# EAGLE design large_sense_pcb_c (EAGLE 9.6.2)
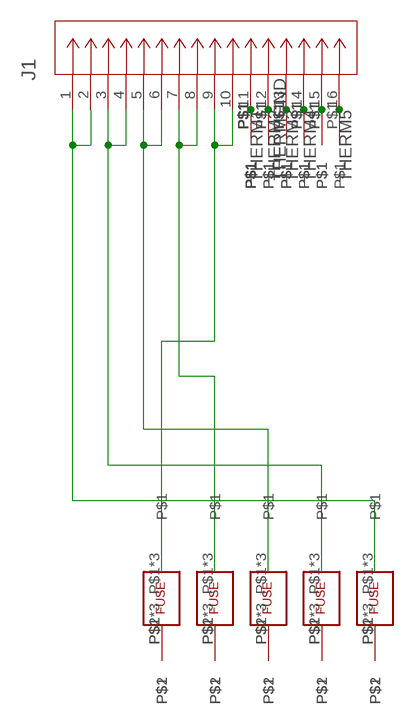
[diagram p0: schematic, sheet 1]

## Parts
J1  DF11-16DP-2DSA(01)  [CONN_DF11-16DP-2DSA(01)_HIR]
U$1  FUSE  [FUSE_PADS]
U$2  FUSE  [FUSE_PADS]
U$3  FUSE  [FUSE_PADS]
U$4  FUSE  [FUSE_PADS]
U$5  FUSE  [FUSE_PADS]
U$6  BB_CONTACT  [BB_CONTACT]
U$7  BB_CONTACT  [BB_CONTACT]
U$8  BB_CONTACT  [BB_CONTACT]
U$9  BB_CONTACT  [BB_CONTACT]
U$10  BB_CONTACT  [BB_CONTACT]
U$12  THERM_PIN  [THERM_PIN]
U$13  THERM_PIN  [THERM_PIN]
U$14  THERM_PIN  [THERM_PIN]
U$15  THERM_PIN  [THERM_PIN]
U$16  THERM_PIN  [THERM_PIN]
U$17  THERM_PIN  [THERM_PIN]
U$18  THERM_PIN  [THERM_PIN]
U$19  THERM_PIN  [THERM_PIN]
U$20  THERM_PIN  [THERM_PIN]
U$22  THERM_PIN  [THERM_PIN]
U$23  THERM_PIN  [THERM_PIN]
U$24  THERM_PIN  [THERM_PIN]
U$25  THERM_PIN  [THERM_PIN]
U$26  THERM_PIN  [THERM_PIN]
U$27  THERM_PIN  [THERM_PIN]
U$28  THERM_PIN  [THERM_PIN]
U$29  THERM_PIN  [THERM_PIN]
U$30  THERM_PIN  [THERM_PIN]

## Nets
N$1: J1.7 J1.8 U$2.P$1 U$2.P$3 U$2.P$5
N$2: U$1.P$2 U$1.P$4 U$1.P$6 U$6.P$1
N$3: J1.1 J1.2 U$5.P$1 U$5.P$3 U$5.P$5
N$4: U$2.P$2 U$2.P$4 U$2.P$6 U$7.P$1
N$5: U$5.P$2 U$5.P$4 U$5.P$6 U$10.P$1
N$6: U$3.P$2 U$3.P$4 U$3.P$6 U$8.P$1
N$7: J1.9 J1.10 U$1.P$1 U$1.P$3 U$1.P$5
N$8: U$4.P$2 U$4.P$4 U$4.P$6 U$9.P$1
N$10: J1.5 J1.6 U$3.P$1 U$3.P$3 U$3.P$5
N$11: J1.3 J1.4 U$4.P$1 U$4.P$3 U$4.P$5
THERM1: J1.12 U$22.P$1 U$23.P$1
THERM2: J1.13 U$24.P$1 U$25.P$1
THERM3: J1.14 U$26.P$1 U$27.P$1
THERM4: J1.15 U$28.P$1 U$29.P$1
THERM5: J1.16 U$30.P$1
THERMGND: J1.11 U$12.P$1 U$13.P$1 U$14.P$1 U$15.P$1 U$16.P$1 U$17.P$1 U$18.P$1 U$19.P$1 U$20.P$1

## Library data of the parts
J1 = sense_pcb_components:DF11-16DP-2DSA(01); COPYRIGHT: Copyright (C) 2023 Ultra Librarian. All rights reserved.; MANUFACTURER_PART_NUMBER: DF11-16DP-2DSA(01); MFR_NAME: Hirose
U$1-U$5 = sense_pcb_components:FUSE
U$6-U$10 = sense_pcb_components:BB_CONTACT
U$12-U$20 U$22-U$30 = sense_pcb_components:THERM_PIN

## Board
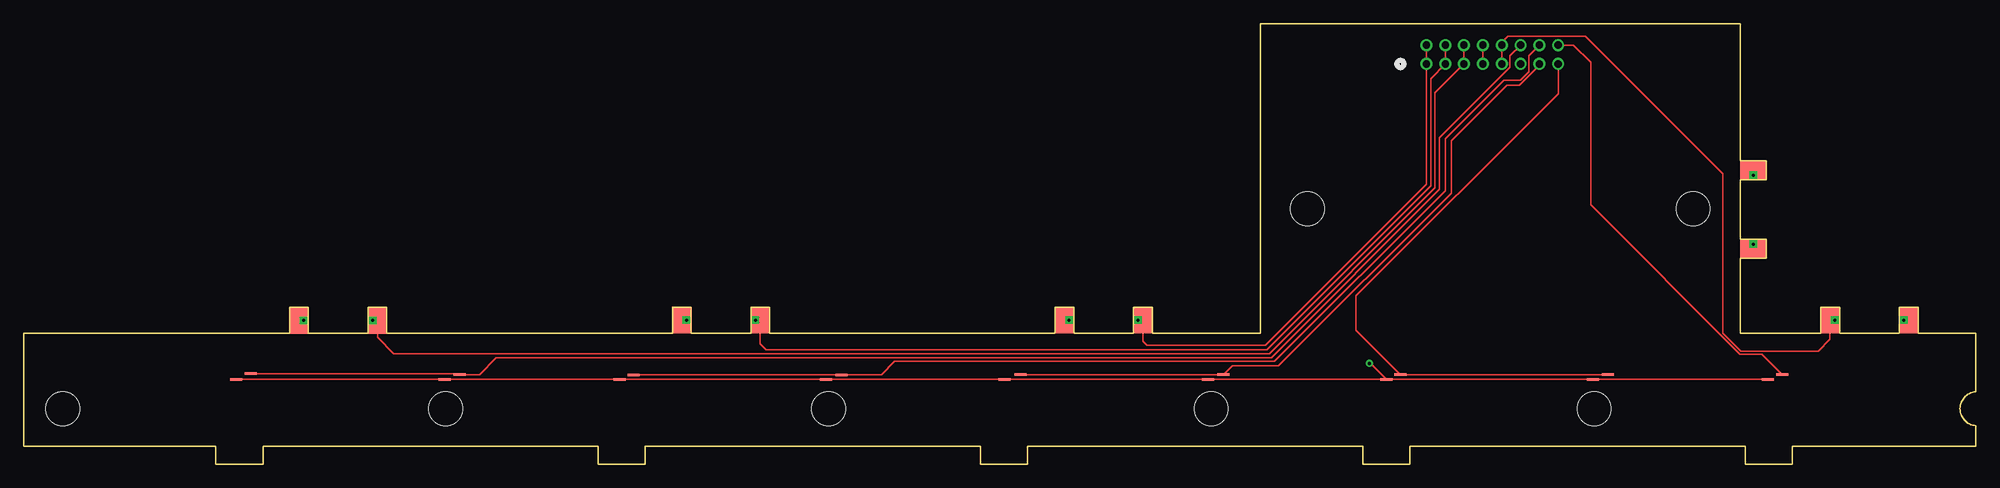
[diagram p1: board, top side]
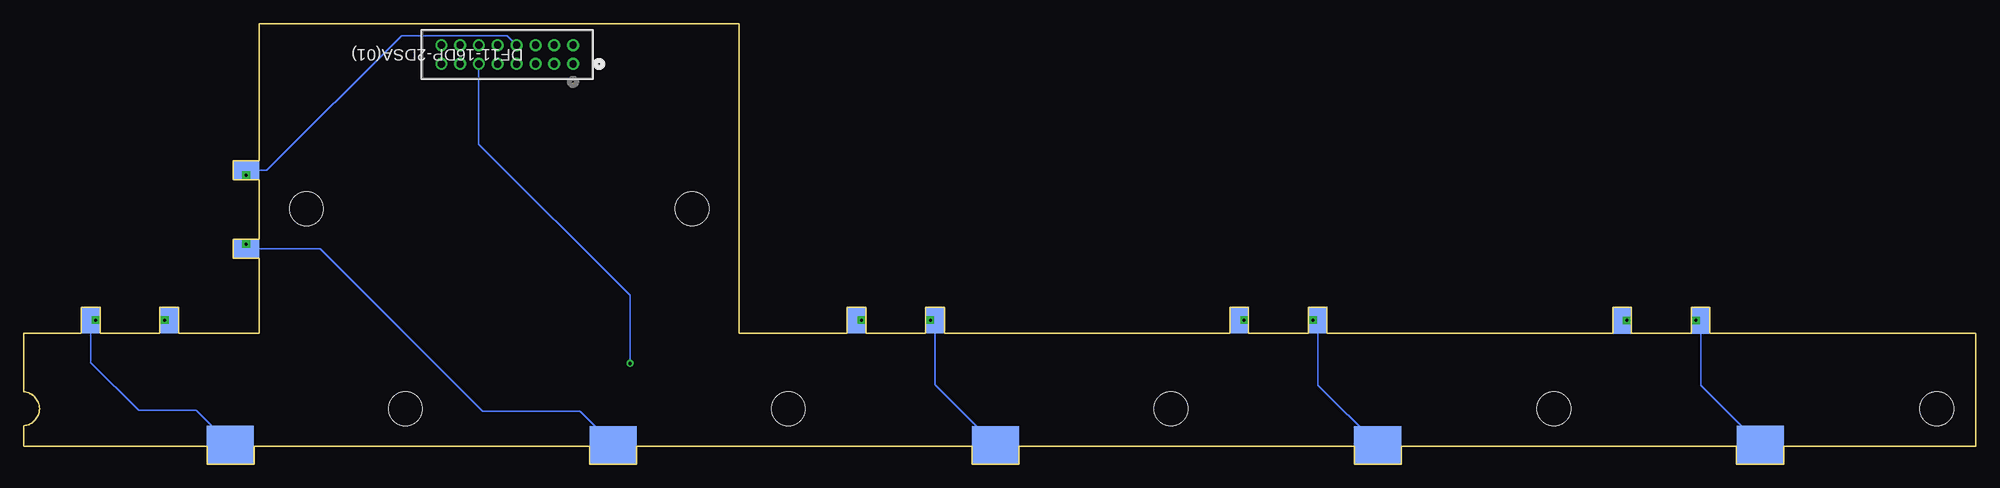
[diagram p2: board, bottom side, seen from below]

Size 207.58 x 46.84 mm. Coordinates in mm from the lower left corner, seen from the top.
Outline: 0,13.9 0,1.9 20.45,1.9 20.45,0 25.45,0 25.45,1.9 61.1,1.9 61.1,0 66.1,0 66.1,1.9 101.75,1.9 101.75,0 106.75,0 106.75,1.9 142.4,1.9 142.4,0 147.4,0 147.4,1.9 183.05,1.9 183.05,0 188.05,0 188.05,1.9 207.58,1.9 207.58,4.1 arc-174 207.58,7.7 207.58,13.9 201.43,13.9 201.43,16.7 199.43,16.7 199.43,13.9 193.08,13.9 193.08,16.7 191.08,16.7 191.08,13.9 182.5,13.9 182.5,21.9 185.3,21.9 185.3,23.9 182.5,23.9 182.5,30.25 185.3,30.25 185.3,32.25 182.5,32.25 182.5,46.84 131.53,46.84 131.53,13.9 120.03,13.9 120.03,16.7 118.03,16.7 118.03,13.9 111.68,13.9 111.68,16.7 109.68,16.7 109.68,13.9 79.33,13.9 79.33,16.7 77.33,16.7 77.33,13.9 70.98,13.9 70.98,16.7 68.98,16.7 68.98,13.9 38.63,13.9 38.63,16.7 36.63,16.7 36.63,13.9 30.28,13.9 30.28,16.7 28.28,16.7 28.28,13.9 0,13.9
Copper layers (1*16): Top 0.035mm / dielectric 1.5mm / Bottom 0.035mm
Design rules "default": minimum track width 6mil, minimum drill 0.35mm, track to track 6mil, track to pad 6mil, pad to pad 6mil, via to via 6mil, smd to smd 6mil, copper to edge 40mil, drill to drill 6mil, minimum pad ring 10mil, minimum via ring 8mil, stop-mask expansion 4mil, vias tented up to drill 0mil, thermal gap 10mil
Holes 3.6 mm at 136.5,27.15 4.18,5.9 166.98,5.9 85.58,5.9 44.88,5.9 126.28,5.9 177.5,27.15

### Footprints (pad centres in the part's own frame; a part is rotated, then mirrored left to right if it is on the bottom)
CONN_DF11-16DP-2DSA(01)_HIR = drill 0.762 pad 1.27: 1 0,0; 2 0,-2.007; 3 2.007,0; 4 2.007,-2.007; 5 3.988,0; 6 3.988,-2.007; 7 5.994,0; 8 5.994,-2.007; 9 8.001,0; 10 8.001,-2.007; 11 10.008,0; 12 10.008,-2.007; 13 11.989,0; 14 11.989,-2.007; 15 13.995,0; 16 13.995,-2.007
FUSE_PADS = smd 2.8 x 2 bottom: P$1 0,0; P$2 0,8.35 | smd 2.8 x 2: P$3 0,0; P$4 0,8.35 | drill 0.305 square: P$5 0,0.508; P$6 0,7.842
BB_CONTACT = smd 5 x 4: P$1 0,0
THERM_PIN = smd 0.279 x 1.27: P$1 0,0

### Placement (x,y rotation side)
J1  149.16,42.54 180 bottom
U$1  192.06,15.31 270 top
U$2  183.91,31.24 180 top
U$3  37.63,15.29 90 top
U$4  78.32,15.31 90 top
U$5  119.01,15.31 90 top
U$6  185.61,2.08 0 bottom
U$7  144.92,2.03 0 bottom
U$8  22.95,2.08 0 bottom
U$9  63.61,2.05 0 bottom
U$10  104.25,2.03 0 bottom
U$12  185.43,9.01 90 top
U$13  166.86,9.01 90 top
U$14  144.89,9.01 90 top
U$15  125.92,9.01 90 top
U$16  104.3,9.01 90 top
U$17  85.3,9.01 90 top
U$18  63.36,9.01 270 top
U$19  44.76,9.01 90 top
U$20  22.59,9.01 90 top
U$22  46.39,9.52 90 top
U$23  24.14,9.62 90 top
U$24  127.57,9.52 90 top
U$25  105.98,9.52 90 top
U$26  86.95,9.49 90 top
U$27  64.86,9.49 90 top
U$28  168.46,9.52 90 top
U$29  146.36,9.52 90 top
U$30  187,9.52 90 top

### Tracks (layer width: path | path; a pad name or v marks a point on that pad's centre or on a via)
N$1
  Top 0.152: 155.15,44.9 J1.8 J1.7 | U$2.P$3 U$2.P$5
  Bottom 0.152: J1.8 156.17,45.56 167.4,45.56 181.72,31.24 U$2.P$3 U$2.P$5
N$2
  Top 0.152: U$1.P$4 U$1.P$6
  Bottom 0.152: U$6.P$1 189.24,5.71 195.34,5.71 200.41,10.78 U$1.P$4 U$1.P$6
N$3
  Top 0.152: J1.2 J1.1 149.16,29.74 132.04,12.62 119.47,12.62 119.01,13.08 U$5.P$3 U$5.P$5
  Bottom 0.152: U$5.P$3 U$5.P$5
N$4
  Top 0.152: U$2.P$4 U$2.P$6
  Bottom 0.152: U$2.P$6 U$2.P$4 176.04,22.89 158.79,5.63 148.4,5.63 144.92,2.15 U$7.P$1
N$5
  Top 0.152: U$5.P$4 U$5.P$6
  Bottom 0.152: U$10.P$1 110.66,8.43 U$5.P$4 U$5.P$6
N$6
  Top 0.152: U$3.P$4 U$3.P$6
  Bottom 0.152: U$8.P$1 29.28,8.41 29.28,14.83 U$3.P$4 U$3.P$6
N$7
  Top 0.152: J1.9 J1.10 157.16,44.8 157.82,45.46 166.05,45.46 180.65,30.86 180.65,13.94 182.58,12.01 190.81,12.01 192.06,13.25 U$1.P$3 U$1.P$5
  Bottom 0.152: U$1.P$3 U$1.P$5
N$8
  Top 0.152: U$4.P$4 U$4.P$6
  Bottom 0.152: U$9.P$1 69.97,8.41 U$4.P$4 U$4.P$6
N$10
  Top 0.152: J1.6 J1.5 150.07,39.47 150.07,29.38 132.45,11.76 39.35,11.76 37.63,13.48 U$3.P$3 U$3.P$5
  Bottom 0.152: U$3.P$3 U$3.P$5
N$11
  Top 0.152: J1.4 J1.3 149.62,40.99 149.62,29.59 132.19,12.16 78.95,12.16 78.32,12.8 U$4.P$3 U$4.P$5
  Bottom 0.152: U$4.P$3 U$4.P$5
THERM1
  Top 0.152: U$23.P$1 46.29,9.62 U$22.P$1 48.47,9.52 50.25,11.3 132.65,11.3 150.56,29.21 150.56,34.71 158.02,42.18 158.02,43.4 J1.12
THERM2
  Top 0.152: U$25.P$1 U$24.P$1 128.51,10.46 133.44,10.46 151.8,28.82 151.8,34.36 157.69,40.25 159.01,40.25 161.15,42.39 J1.13
THERM3
  Top 0.152: U$27.P$1 U$26.P$1 91.2,9.49 92.62,10.92 133,10.92 151.17,29.08 151.17,34.59 157.36,40.79 159.12,40.79 160.03,41.7 160.03,43.43 J1.14
THERM4
  Top 0.152: U$28.P$1 U$29.P$1 141.67,14.22 141.67,17.88 163.15,39.37 J1.15
THERM5
  Top 0.152: U$30.P$1 184.82,11.7 182.46,11.7 166.61,27.55 166.61,42.72 164.78,44.55 J1.16
THERMGND  (via drill 0.35)
  Top 0.152: U$20.P$1 U$19.P$1 U$18.P$1 U$17.P$1 U$16.P$1 U$15.P$1 U$14.P$1 | U$14.P$1 U$13.P$1 U$12.P$1 | U$14.P$1 143.19,10.71 v143.09,10.71
  Bottom 0.152: v143.09,10.71 143.09,17.95 159.17,34.03 J1.11